# Altium schematic sheet Salico Controller Module.SchDoc
size 558 x 431 mm; SheetNumber: 1; SheetTotal: 1
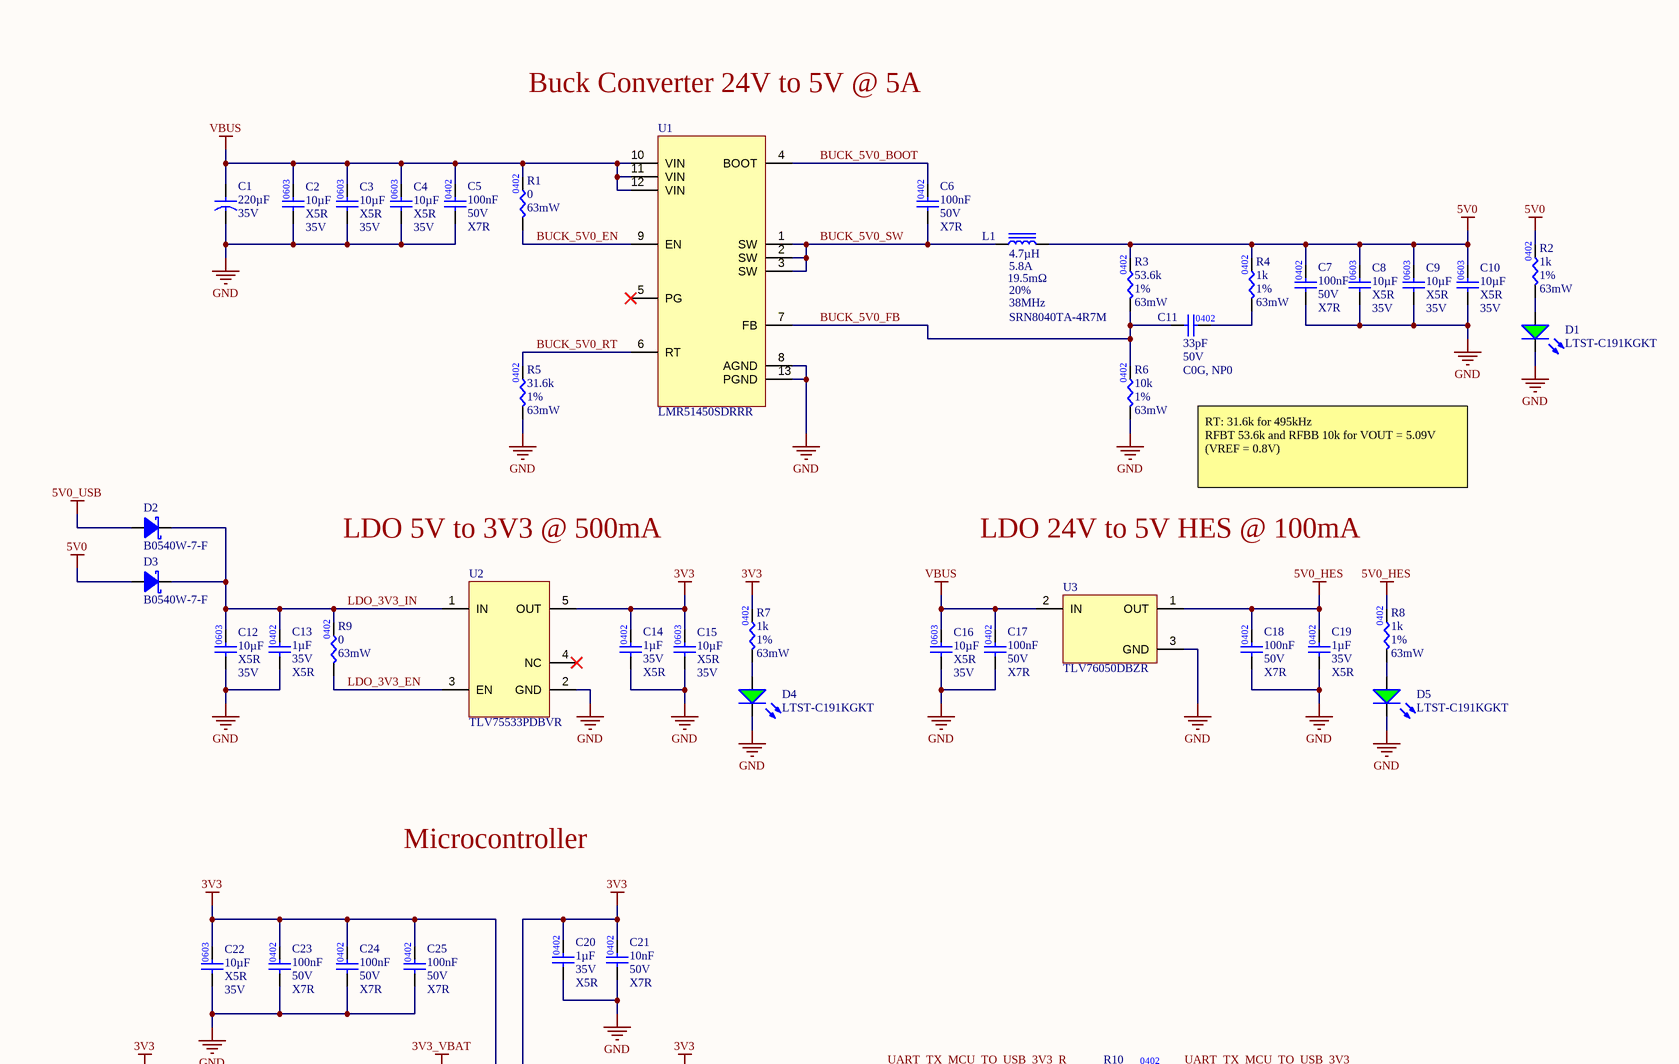
[diagram p0: Salico Controller Module.SchDoc, top left]
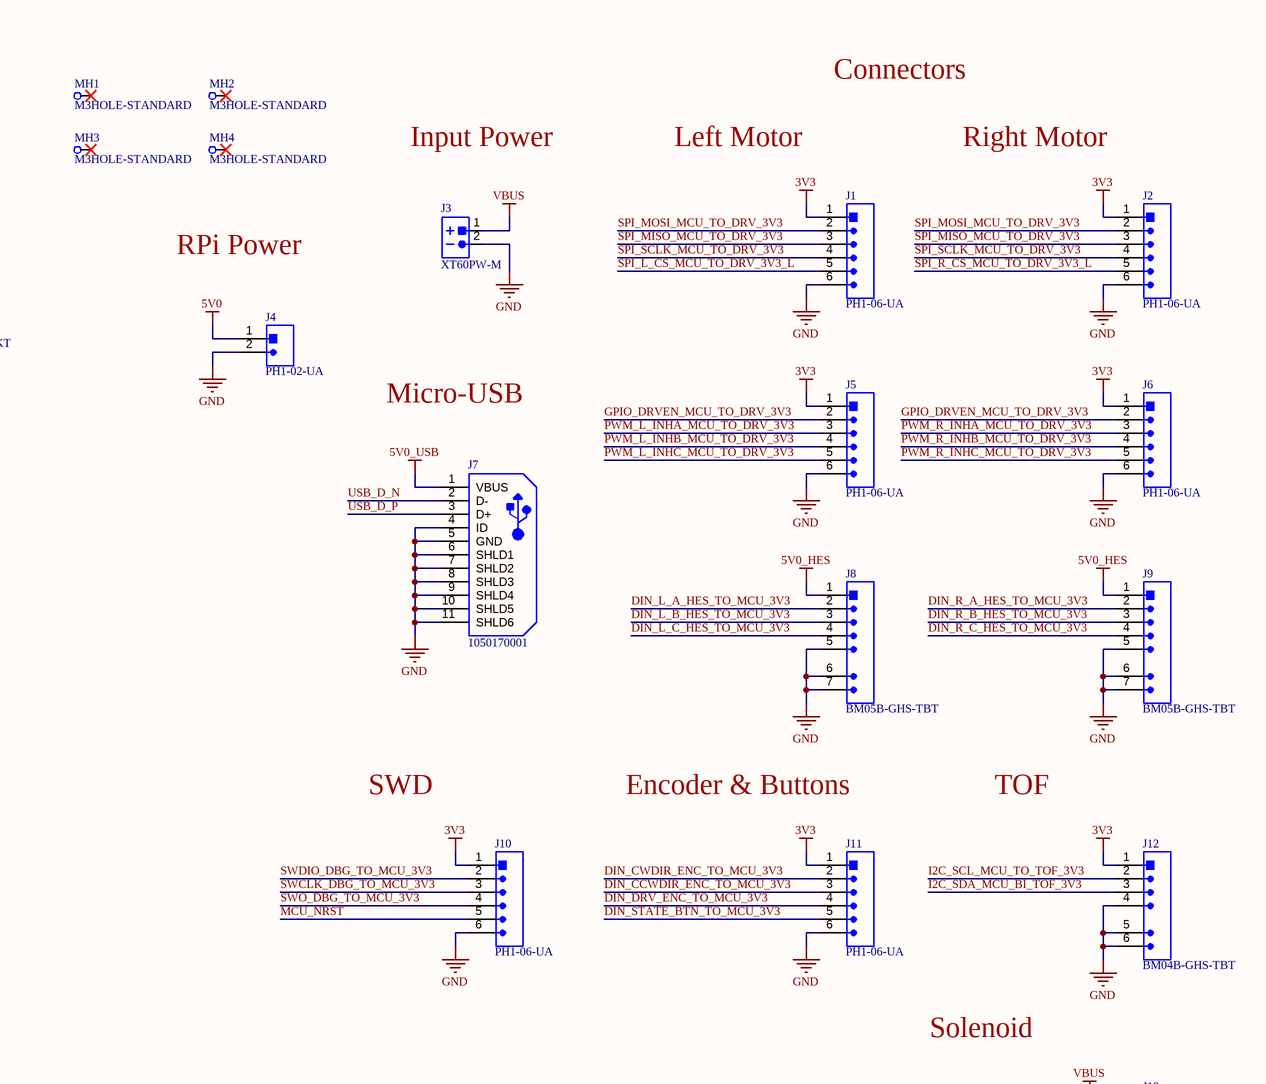
[diagram p1: Salico Controller Module.SchDoc, top right]
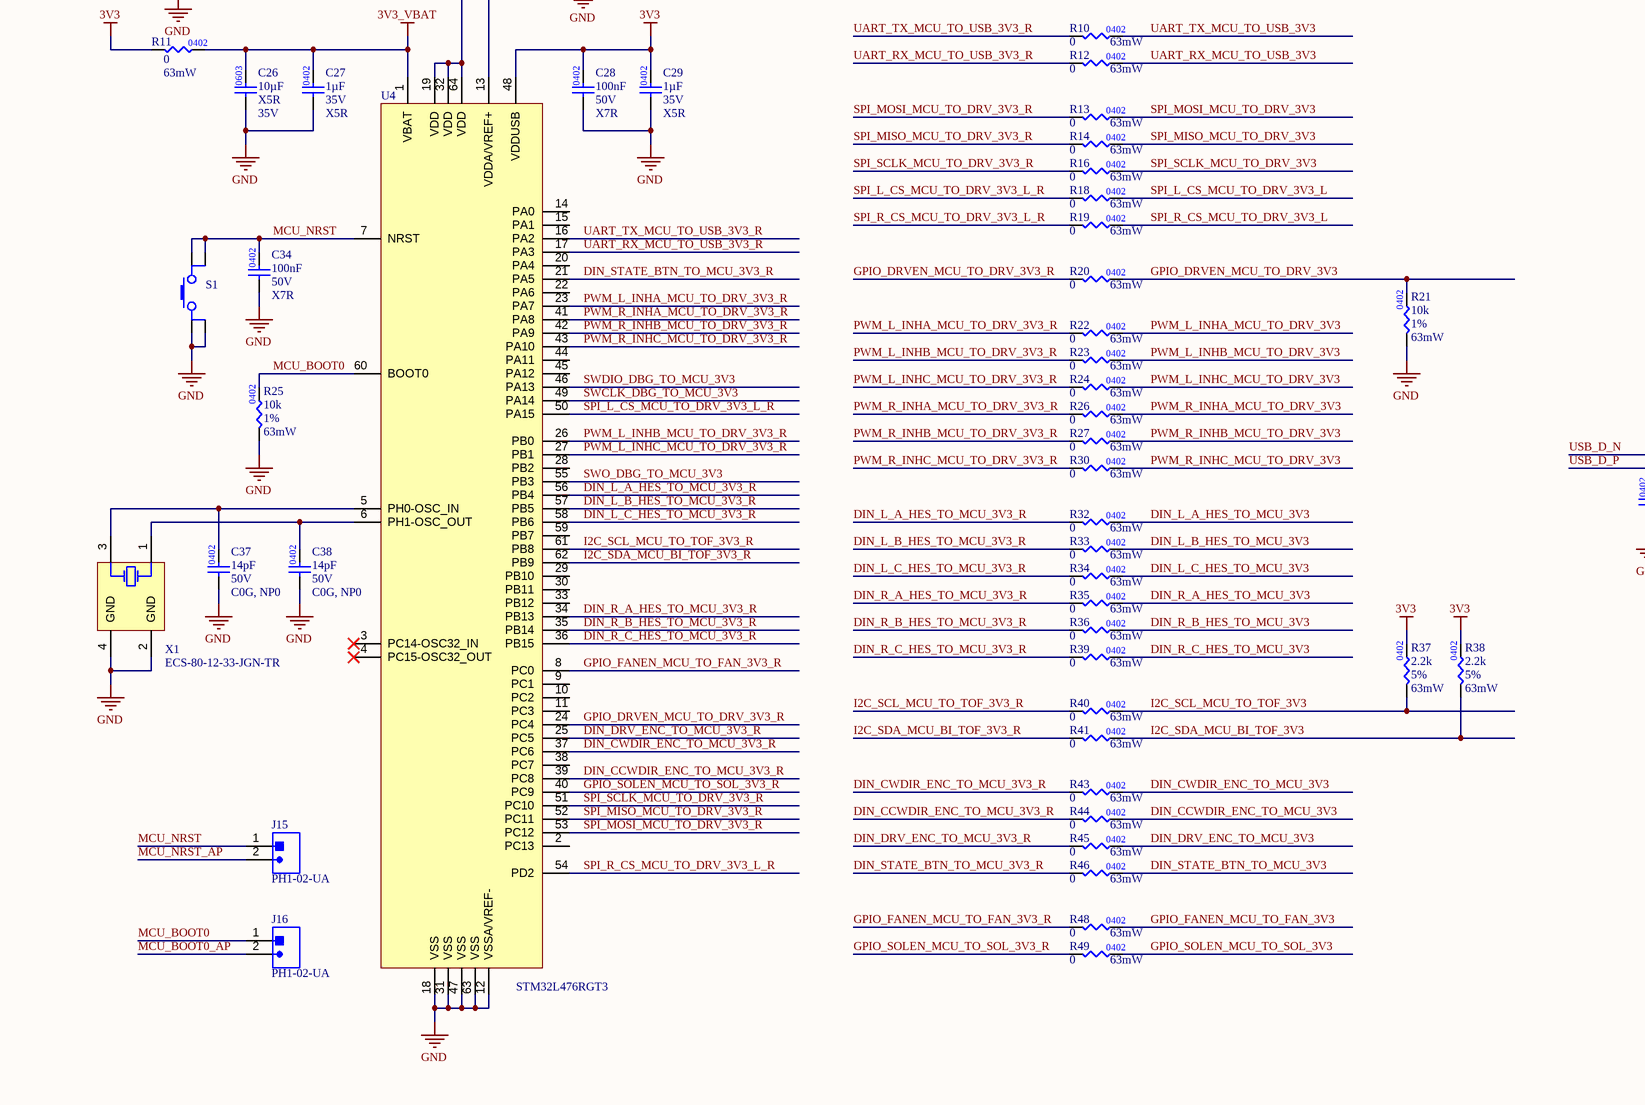
[diagram p2: Salico Controller Module.SchDoc, bottom left]
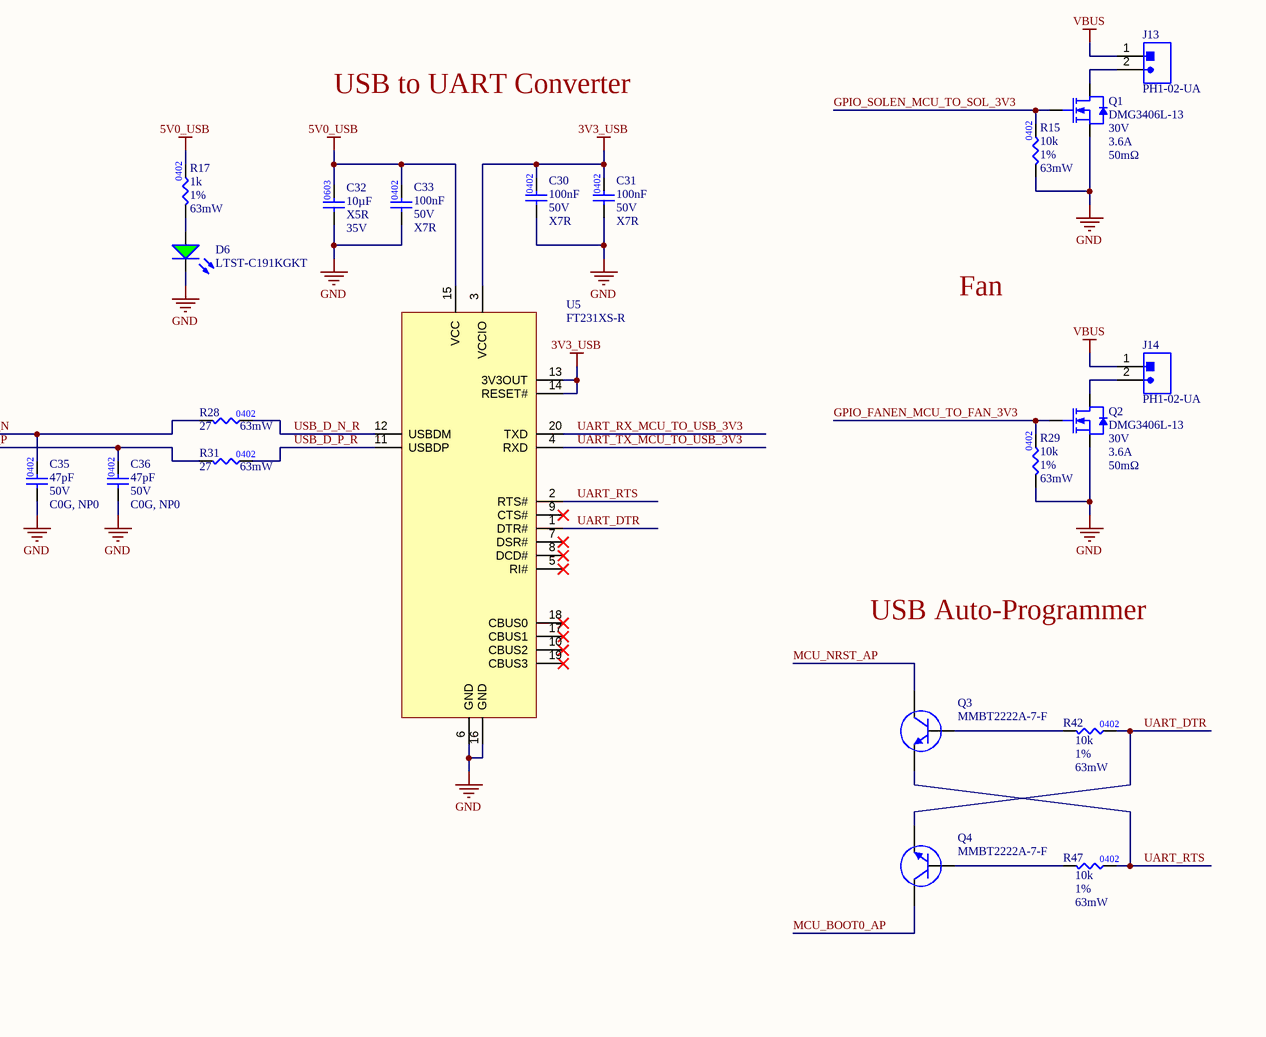
[diagram p3: Salico Controller Module.SchDoc, bottom right]

## Parts
C1  value 220µF  Voltage Rating: 35V  [865080553014-Footprint-1]  (hidden comment: 865080553014)
C2  value 10µF  Temperature Coefficient: X5R  Voltage Rating: 35V  [.CAP_0603-Footprint-1]  (hidden comment: GRM188R6YA106MA73D)
C3  value 10µF  Temperature Coefficient: X5R  Voltage Rating: 35V  [.CAP_0603-Footprint-1]  (hidden comment: GRM188R6YA106MA73D)
C4  value 10µF  Temperature Coefficient: X5R  Voltage Rating: 35V  [.CAP_0603-Footprint-1]  (hidden comment: GRM188R6YA106MA73D)
C5  value 100nF  Voltage Rating: 50V  Temperature Coefficient: X7R  [.CAP_0402-Footprint-1]  (hidden comment: GCM155R71H104KE02D)
C6  value 100nF  Voltage Rating: 50V  Temperature Coefficient: X7R  [.CAP_0402-Footprint-1]  (hidden comment: GCM155R71H104KE02D)
C7  value 100nF  Voltage Rating: 50V  Temperature Coefficient: X7R  [.CAP_0402-Footprint-1]  (hidden comment: GCM155R71H104KE02D)
C8  value 10µF  Temperature Coefficient: X5R  Voltage Rating: 35V  [.CAP_0603-Footprint-1]  (hidden comment: GRM188R6YA106MA73D)
C9  value 10µF  Temperature Coefficient: X5R  Voltage Rating: 35V  [.CAP_0603-Footprint-1]  (hidden comment: GRM188R6YA106MA73D)
C10  value 10µF  Temperature Coefficient: X5R  Voltage Rating: 35V  [.CAP_0603-Footprint-1]  (hidden comment: GRM188R6YA106MA73D)
C11  value 33pF  Voltage Rating: 50V  Temperature Coefficient: C0G, NP0  [.CAP_0402-Footprint-1]  (hidden comment: GRM1555C1H330JA01D)
C12  value 10µF  Temperature Coefficient: X5R  Voltage Rating: 35V  [.CAP_0603-Footprint-1]  (hidden comment: GRM188R6YA106MA73D)
C13  value 1µF  Voltage Rating: 35V  Temperature Coefficient: X5R  [.CAP_0402-Footprint-1]  (hidden comment: GRM155R6YA105KE11D)
C14  value 1µF  Voltage Rating: 35V  Temperature Coefficient: X5R  [.CAP_0402-Footprint-1]  (hidden comment: GRM155R6YA105KE11D)
C15  value 10µF  Temperature Coefficient: X5R  Voltage Rating: 35V  [.CAP_0603-Footprint-1]  (hidden comment: GRM188R6YA106MA73D)
C16  value 10µF  Temperature Coefficient: X5R  Voltage Rating: 35V  [.CAP_0603-Footprint-1]  (hidden comment: GRM188R6YA106MA73D)
C17  value 100nF  Voltage Rating: 50V  Temperature Coefficient: X7R  [.CAP_0402-Footprint-1]  (hidden comment: GCM155R71H104KE02D)
C18  value 100nF  Voltage Rating: 50V  Temperature Coefficient: X7R  [.CAP_0402-Footprint-1]  (hidden comment: GCM155R71H104KE02D)
C19  value 1µF  Voltage Rating: 35V  Temperature Coefficient: X5R  [.CAP_0402-Footprint-1]  (hidden comment: GRM155R6YA105KE11D)
C20  value 1µF  Voltage Rating: 35V  Temperature Coefficient: X5R  [.CAP_0402-Footprint-1]  (hidden comment: GRM155R6YA105KE11D)
C21  value 10nF  Voltage Rating: 50V  Temperature Coefficient: X7R  [.CAP_0402-Footprint-1]  (hidden comment: GCM155R71H103KA55D)
C22  value 10µF  Temperature Coefficient: X5R  Voltage Rating: 35V  [.CAP_0603-Footprint-1]  (hidden comment: GRM188R6YA106MA73D)
C23  value 100nF  Voltage Rating: 50V  Temperature Coefficient: X7R  [.CAP_0402-Footprint-1]  (hidden comment: GCM155R71H104KE02D)
C24  value 100nF  Voltage Rating: 50V  Temperature Coefficient: X7R  [.CAP_0402-Footprint-1]  (hidden comment: GCM155R71H104KE02D)
C25  value 100nF  Voltage Rating: 50V  Temperature Coefficient: X7R  [.CAP_0402-Footprint-1]  (hidden comment: GCM155R71H104KE02D)
C26  value 10µF  Temperature Coefficient: X5R  Voltage Rating: 35V  [.CAP_0603-Footprint-1]  (hidden comment: GRM188R6YA106MA73D)
C27  value 1µF  Voltage Rating: 35V  Temperature Coefficient: X5R  [.CAP_0402-Footprint-1]  (hidden comment: GRM155R6YA105KE11D)
C28  value 100nF  Voltage Rating: 50V  Temperature Coefficient: X7R  [.CAP_0402-Footprint-1]  (hidden comment: GCM155R71H104KE02D)
C29  value 1µF  Voltage Rating: 35V  Temperature Coefficient: X5R  [.CAP_0402-Footprint-1]  (hidden comment: GRM155R6YA105KE11D)
C30  value 100nF  Voltage Rating: 50V  Temperature Coefficient: X7R  [.CAP_0402-Footprint-1]  (hidden comment: GCM155R71H104KE02D)
C31  value 100nF  Voltage Rating: 50V  Temperature Coefficient: X7R  [.CAP_0402-Footprint-1]  (hidden comment: GCM155R71H104KE02D)
C32  value 10µF  Temperature Coefficient: X5R  Voltage Rating: 35V  [.CAP_0603-Footprint-1]  (hidden comment: GRM188R6YA106MA73D)
C33  value 100nF  Voltage Rating: 50V  Temperature Coefficient: X7R  [.CAP_0402-Footprint-1]  (hidden comment: GCM155R71H104KE02D)
C34  value 100nF  Voltage Rating: 50V  Temperature Coefficient: X7R  [.CAP_0402-Footprint-1]  (hidden comment: GCM155R71H104KE02D)
C35  value 47pF  Voltage Rating: 50V  Temperature Coefficient: C0G, NP0  [.CAP_0402-Footprint-1]  (hidden comment: GRM1555C1H470JA01D)
C36  value 47pF  Voltage Rating: 50V  Temperature Coefficient: C0G, NP0  [.CAP_0402-Footprint-1]  (hidden comment: GRM1555C1H470JA01D)
C37  value 14pF  Voltage Rating: 50V  Temperature Coefficient: C0G, NP0  [.CAP_0402-Footprint-1]  (hidden comment: GJM1555C1H140GB01D)
C38  value 14pF  Voltage Rating: 50V  Temperature Coefficient: C0G, NP0  [.CAP_0402-Footprint-1]  (hidden comment: GJM1555C1H140GB01D)
D1  LTST-C191KGKT  [LTST-C191KGKT-Footprint-1]
D2  B0540W-7-F  [B0540W-7-F-Footprint-1]
D3  B0540W-7-F  [B0540W-7-F-Footprint-1]
D4  LTST-C191KGKT  [LTST-C191KGKT-Footprint-1]
D5  LTST-C191KGKT  [LTST-C191KGKT-Footprint-1]
D6  LTST-C191KGKT  [LTST-C191KGKT-Footprint-1]
J1  PH1-06-UA  [PH1-06-UA-Footprint-1]
J2  PH1-06-UA  [PH1-06-UA-Footprint-1]
J3  XT60PW-M  [XT60PW-M-Footprint-1]
J4  PH1-02-UA  [PH1-02-UA-Footprint-1]
J5  PH1-06-UA  [PH1-06-UA-Footprint-1]
J6  PH1-06-UA  [PH1-06-UA-Footprint-1]
J7  1050170001  [1050170001-Footprint-1]
J8  BM05B-GHS-TBT  [BM05B-GHS-TBT-Footprint-1]
J9  BM05B-GHS-TBT  [BM05B-GHS-TBT-Footprint-1]
J10  PH1-06-UA  [PH1-06-UA-Footprint-1]
J11  PH1-06-UA  [PH1-06-UA-Footprint-1]
J12  BM04B-GHS-TBT  [BM04B-GHS-TBT-Footprint-1]
J13  PH1-02-UA  [PH1-02-UA-Footprint-1]
J14  PH1-02-UA  [PH1-02-UA-Footprint-1]
J15  PH1-02-UA  [PH1-02-UA-Footprint-1]
J16  PH1-02-UA  [PH1-02-UA-Footprint-1]
L1  SRN8040TA-4R7M  value 4.7µH  Current Rating: 5.8A  DC Resistance: 19.5mΩ  Tolerance: 20%  Self Resonant Frequency: 38MHz  [SRN8040TA-4R7M-Footprint-1]
MH1  M3HOLE-STANDARD  [M3HOLE-STANDARD-Footprint-1]
MH2  M3HOLE-STANDARD  [M3HOLE-STANDARD-Footprint-1]
MH3  M3HOLE-STANDARD  [M3HOLE-STANDARD-Footprint-1]
MH4  M3HOLE-STANDARD  [M3HOLE-STANDARD-Footprint-1]
Q1  DMG3406L-13  Drain to Source Voltage: 30V  Continuous Drain Current: 3.6A  Rdson: 50mΩ  [DMG3406L-13-Footprint-1]
Q2  DMG3406L-13  Drain to Source Voltage: 30V  Continuous Drain Current: 3.6A  Rdson: 50mΩ  [DMG3406L-13-Footprint-1]
Q3  MMBT2222A-7-F  [MMBT2222A-7-F-Footprint-1]
Q4  MMBT2222A-7-F  [MMBT2222A-7-F-Footprint-1]
R1  value 0  Power: 63mW  [.RES_0402-Footprint-1]  (hidden comment: RC0402JR-070RL)
R2  value 1k  Tolerance: 1%  Power: 63mW  [.RES_0402-Footprint-1]  (hidden comment: RC0402FR-071KL)
R3  value 53.6k  Tolerance: 1%  Power: 63mW  [.RES_0402-Footprint-1]  (hidden comment: RC0402FR-0753K6L)
R4  value 1k  Tolerance: 1%  Power: 63mW  [.RES_0402-Footprint-1]  (hidden comment: RC0402FR-071KL)
R5  value 31.6k  Tolerance: 1%  Power: 63mW  [.RES_0402-Footprint-1]  (hidden comment: RC0402FR-0731K6L)
R6  value 10k  Tolerance: 1%  Power: 63mW  [.RES_0402-Footprint-1]  (hidden comment: RC0402FR-0710KL)
R7  value 1k  Tolerance: 1%  Power: 63mW  [.RES_0402-Footprint-1]  (hidden comment: RC0402FR-071KL)
R8  value 1k  Tolerance: 1%  Power: 63mW  [.RES_0402-Footprint-1]  (hidden comment: RC0402FR-071KL)
R9  value 0  Power: 63mW  [.RES_0402-Footprint-1]  (hidden comment: RC0402JR-070RL)
R10  value 0  Power: 63mW  [.RES_0402-Footprint-1]  (hidden comment: RC0402JR-070RL)
R11  value 0  Power: 63mW  [.RES_0402-Footprint-1]  (hidden comment: RC0402JR-070RL)
R12  value 0  Power: 63mW  [.RES_0402-Footprint-1]  (hidden comment: RC0402JR-070RL)
R13  value 0  Power: 63mW  [.RES_0402-Footprint-1]  (hidden comment: RC0402JR-070RL)
R14  value 0  Power: 63mW  [.RES_0402-Footprint-1]  (hidden comment: RC0402JR-070RL)
R15  value 10k  Tolerance: 1%  Power: 63mW  [.RES_0402-Footprint-1]  (hidden comment: RC0402FR-0710KL)
R16  value 0  Power: 63mW  [.RES_0402-Footprint-1]  (hidden comment: RC0402JR-070RL)
R17  value 1k  Tolerance: 1%  Power: 63mW  [.RES_0402-Footprint-1]  (hidden comment: RC0402FR-071KL)
R18  value 0  Power: 63mW  [.RES_0402-Footprint-1]  (hidden comment: RC0402JR-070RL)
R19  value 0  Power: 63mW  [.RES_0402-Footprint-1]  (hidden comment: RC0402JR-070RL)
R20  value 0  Power: 63mW  [.RES_0402-Footprint-1]  (hidden comment: RC0402JR-070RL)
R21  value 10k  Tolerance: 1%  Power: 63mW  [.RES_0402-Footprint-1]  (hidden comment: RC0402FR-0710KL)
R22  value 0  Power: 63mW  [.RES_0402-Footprint-1]  (hidden comment: RC0402JR-070RL)
R23  value 0  Power: 63mW  [.RES_0402-Footprint-1]  (hidden comment: RC0402JR-070RL)
R24  value 0  Power: 63mW  [.RES_0402-Footprint-1]  (hidden comment: RC0402JR-070RL)
R25  value 10k  Tolerance: 1%  Power: 63mW  [.RES_0402-Footprint-1]  (hidden comment: RC0402FR-0710KL)
R26  value 0  Power: 63mW  [.RES_0402-Footprint-1]  (hidden comment: RC0402JR-070RL)
R27  value 0  Power: 63mW  [.RES_0402-Footprint-1]  (hidden comment: RC0402JR-070RL)
R28  value 27  Power: 63mW  [.RES_0402-Footprint-1]  (hidden comment: RC0402FR-0727RL)
R29  value 10k  Tolerance: 1%  Power: 63mW  [.RES_0402-Footprint-1]  (hidden comment: RC0402FR-0710KL)
R30  value 0  Power: 63mW  [.RES_0402-Footprint-1]  (hidden comment: RC0402JR-070RL)
R31  value 27  Power: 63mW  [.RES_0402-Footprint-1]  (hidden comment: RC0402FR-0727RL)
R32  value 0  Power: 63mW  [.RES_0402-Footprint-1]  (hidden comment: RC0402JR-070RL)
R33  value 0  Power: 63mW  [.RES_0402-Footprint-1]  (hidden comment: RC0402JR-070RL)
R34  value 0  Power: 63mW  [.RES_0402-Footprint-1]  (hidden comment: RC0402JR-070RL)
R35  value 0  Power: 63mW  [.RES_0402-Footprint-1]  (hidden comment: RC0402JR-070RL)
R36  value 0  Power: 63mW  [.RES_0402-Footprint-1]  (hidden comment: RC0402JR-070RL)
R37  value 2.2k  Tolerance: 5%  Power: 63mW  [.RES_0402-Footprint-1]  (hidden comment: RC0402JR-072K2L)
R38  value 2.2k  Tolerance: 5%  Power: 63mW  [.RES_0402-Footprint-1]  (hidden comment: RC0402JR-072K2L)
R39  value 0  Power: 63mW  [.RES_0402-Footprint-1]  (hidden comment: RC0402JR-070RL)
R40  value 0  Power: 63mW  [.RES_0402-Footprint-1]  (hidden comment: RC0402JR-070RL)
R41  value 0  Power: 63mW  [.RES_0402-Footprint-1]  (hidden comment: RC0402JR-070RL)
R42  value 10k  Tolerance: 1%  Power: 63mW  [.RES_0402-Footprint-1]  (hidden comment: RC0402FR-0710KL)
R43  value 0  Power: 63mW  [.RES_0402-Footprint-1]  (hidden comment: RC0402JR-070RL)
R44  value 0  Power: 63mW  [.RES_0402-Footprint-1]  (hidden comment: RC0402JR-070RL)
R45  value 0  Power: 63mW  [.RES_0402-Footprint-1]  (hidden comment: RC0402JR-070RL)
R46  value 0  Power: 63mW  [.RES_0402-Footprint-1]  (hidden comment: RC0402JR-070RL)
R47  value 10k  Tolerance: 1%  Power: 63mW  [.RES_0402-Footprint-1]  (hidden comment: RC0402FR-0710KL)
R48  value 0  Power: 63mW  [.RES_0402-Footprint-1]  (hidden comment: RC0402JR-070RL)
R49  value 0  Power: 63mW  [.RES_0402-Footprint-1]  (hidden comment: RC0402JR-070RL)
S1  PTS647SN38SMTR2 LFS  [PTS647SN38SMTR2 LFS-Footprint-1]  (value not drawn)
U1  LMR51450SDRRR  [SON50P300X80_HS-13N]
U2  TLV75533PDBVR  [TLV75533PDBVR-Footprint-1]
U3  TLV76050DBZR  [TLV76050DBZR-Footprint-1]
U4  STM32L476RGT3  [STM32L476RGT3-Footprint-1]
U5  FT231XS-R  [SOP64P600X175-20N]
X1  ECS-80-12-33-JGN-TR  [ECS-80-12-33-JGN-TR-Footprint-1]

## Nets
3V3: C14.2 C15.2 C20.2 C21.2 C22.2 C23.2 C24.2 C25.2 C28.2 C29.2 J1.1 J2.1 J5.1 J6.1 J10.1 J11.1 J12.1 R7.2 R11.1 R37.2 R38.2 U2.5(OUT) U4.13(VDDA/VREF+) U4.19(VDD) U4.32(VDD) U4.48(VDDUSB) U4.64(VDD)
3V3_USB: C30.2 C31.2 U5.3(VCCIO) U5.13(3V3OUT) U5.14(RESET#)
3V3_VBAT: C26.2 C27.2 R11.2 U4.1(VBAT)
5V0: C7.2 C8.2 C9.2 C10.2 D3.1(Anode) J4.1 L1.2 R2.2 R3.2 R4.2
5V0_HES: C18.2 C19.2 J8.1 J9.1 R8.2 U3.1(OUT)
5V0_USB: C32.2 C33.2 D2.1(Anode) J7.1(VBUS) R17.2 U5.15(VCC)
GND: C1.2 C2.1 C3.1 C4.1 C5.1 C7.1 C8.1 C9.1 C10.1 C12.1 C13.1 C14.1 C15.1 C16.1 C17.1 C18.1 C19.1 C20.1 C21.1 C22.1 C23.1 C24.1 C25.1 C26.1 C27.1 C28.1 C29.1 C30.1 C31.1 C32.1 C33.1 C34.1 C35.1 C36.1 C37.1 C38.1 D1.2(K) D4.2(K) D5.2(K) D6.2(K) J1.6 J2.6 J3.2 J4.2 J5.6 J6.6 J7.4(ID) J7.5(GND) J7.6(SHLD1) J7.7(SHLD2) J7.8(SHLD3) J7.9(SHLD4) J7.10(SHLD5) J7.11(SHLD6) J8.5 J8.6 J8.7 J9.5 J9.6 J9.7 J10.6 J11.6 J12.4 J12.5 J12.6 Q1.2(S) Q2.2(S) R5.1 R6.1 R15.1 R21.1 R25.1 R29.1 S1.1 S1.2 U1.8(AGND) U1.13(PGND) U2.2(GND) U3.3(GND) U4.12(VSSA/VREF-) U4.18(VSS) U4.31(VSS) U4.47(VSS) U4.63(VSS) U5.6(GND) U5.16(GND) X1.2(GND) X1.4(GND)
VBUS: C1.1 C2.2 C3.2 C4.2 C5.2 C16.2 C17.2 J3.1 J13.1 J14.1 R1.2 U1.10(VIN) U1.11(VIN) U1.12(VIN) U3.2(IN)
BUCK_5V0_BOOT: C6.2 U1.4(BOOT)
BUCK_5V0_EN: R1.1 U1.9(EN)
BUCK_5V0_FB: C11.1 R3.1 R6.2 U1.7(FB)
BUCK_5V0_RT: R5.2 U1.6(RT)
BUCK_5V0_SW: C6.1 L1.1 U1.1(SW) U1.2(SW) U1.3(SW)
DIN_CCWDIR_ENC_TO_MCU_3V3: J11.3 R44.2
DIN_CCWDIR_ENC_TO_MCU_3V3_R: R44.1 U4.39(PC8)
DIN_CWDIR_ENC_TO_MCU_3V3: J11.2 R43.2
DIN_CWDIR_ENC_TO_MCU_3V3_R: R43.1 U4.37(PC6)
DIN_DRV_ENC_TO_MCU_3V3: J11.4 R45.2
DIN_DRV_ENC_TO_MCU_3V3_R: R45.1 U4.25(PC5)
DIN_L_A_HES_TO_MCU_3V3: J8.2 R32.2
DIN_L_A_HES_TO_MCU_3V3_R: R32.1 U4.56(PB4)
DIN_L_B_HES_TO_MCU_3V3: J8.3 R33.2
DIN_L_B_HES_TO_MCU_3V3_R: R33.1 U4.57(PB5)
DIN_L_C_HES_TO_MCU_3V3: J8.4 R34.2
DIN_L_C_HES_TO_MCU_3V3_R: R34.1 U4.58(PB6)
DIN_R_A_HES_TO_MCU_3V3: J9.2 R35.2
DIN_R_A_HES_TO_MCU_3V3_R: R35.1 U4.34(PB13)
DIN_R_B_HES_TO_MCU_3V3: J9.3 R36.2
DIN_R_B_HES_TO_MCU_3V3_R: R36.1 U4.35(PB14)
DIN_R_C_HES_TO_MCU_3V3: J9.4 R39.2
DIN_R_C_HES_TO_MCU_3V3_R: R39.1 U4.36(PB15)
DIN_STATE_BTN_TO_MCU_3V3: J11.5 R46.2
DIN_STATE_BTN_TO_MCU_3V3_R: R46.1 U4.21(PA5)
GPIO_DRVEN_MCU_TO_DRV_3V3: J5.2 J6.2 R20.2 R21.2
GPIO_DRVEN_MCU_TO_DRV_3V3_R: R20.1 U4.24(PC4)
GPIO_FANEN_MCU_TO_FAN_3V3: Q2.1(G) R29.2 R48.2
GPIO_FANEN_MCU_TO_FAN_3V3_R: R48.1 U4.8(PC0)
GPIO_SOLEN_MCU_TO_SOL_3V3: Q1.1(G) R15.2 R49.2
GPIO_SOLEN_MCU_TO_SOL_3V3_R: R49.1 U4.40(PC9)
I2C_SCL_MCU_TO_TOF_3V3: J12.2 R37.1 R40.2
I2C_SCL_MCU_TO_TOF_3V3_R: R40.1 U4.61(PB8)
I2C_SDA_MCU_BI_TOF_3V3: J12.3 R38.1 R41.2
I2C_SDA_MCU_BI_TOF_3V3_R: R41.1 U4.62(PB9)
LDO_3V3_EN: R9.1 U2.3(EN)
LDO_3V3_IN: C12.2 C13.2 D2.2(Cathode) D3.2(Cathode) R9.2 U2.1(IN)
MCU_BOOT0: J16.1 R25.2 U4.60(BOOT0)
MCU_BOOT0_AP: J16.2 Q4.3(C)
MCU_NRST: C34.2 J10.5 J15.1 S1.3 S1.4 U4.7(NRST)
MCU_NRST_AP: J15.2 Q3.3(C)
PWM_L_INHA_MCU_TO_DRV_3V3: J5.3 R22.2
PWM_L_INHA_MCU_TO_DRV_3V3_R: R22.1 U4.23(PA7)
PWM_L_INHB_MCU_TO_DRV_3V3: J5.4 R23.2
PWM_L_INHB_MCU_TO_DRV_3V3_R: R23.1 U4.26(PB0)
PWM_L_INHC_MCU_TO_DRV_3V3: J5.5 R24.2
PWM_L_INHC_MCU_TO_DRV_3V3_R: R24.1 U4.27(PB1)
PWM_R_INHA_MCU_TO_DRV_3V3: J6.3 R26.2
PWM_R_INHA_MCU_TO_DRV_3V3_R: R26.1 U4.41(PA8)
PWM_R_INHB_MCU_TO_DRV_3V3: J6.4 R27.2
PWM_R_INHB_MCU_TO_DRV_3V3_R: R27.1 U4.42(PA9)
PWM_R_INHC_MCU_TO_DRV_3V3: J6.5 R30.2
PWM_R_INHC_MCU_TO_DRV_3V3_R: R30.1 U4.43(PA10)
SPI_L_CS_MCU_TO_DRV_3V3_L: J1.5 R18.2
SPI_L_CS_MCU_TO_DRV_3V3_L_R: R18.1 U4.50(PA15)
SPI_MISO_MCU_TO_DRV_3V3: J1.3 J2.3 R14.2
SPI_MISO_MCU_TO_DRV_3V3_R: R14.1 U4.52(PC11)
SPI_MOSI_MCU_TO_DRV_3V3: J1.2 J2.2 R13.2
SPI_MOSI_MCU_TO_DRV_3V3_R: R13.1 U4.53(PC12)
SPI_R_CS_MCU_TO_DRV_3V3_L: J2.5 R19.2
SPI_R_CS_MCU_TO_DRV_3V3_L_R: R19.1 U4.54(PD2)
SPI_SCLK_MCU_TO_DRV_3V3: J1.4 J2.4 R16.2
SPI_SCLK_MCU_TO_DRV_3V3_R: R16.1 U4.51(PC10)
SWCLK_DBG_TO_MCU_3V3: J10.3 U4.49(PA14)
SWDIO_DBG_TO_MCU_3V3: J10.2 U4.46(PA13)
SWO_DBG_TO_MCU_3V3: J10.4 U4.55(PB3)
UART_DTR: Q4.1(E) R42.2 U5.1(DTR#)
UART_RTS: Q3.1(E) R47.2 U5.2(RTS#)
UART_RX_MCU_TO_USB_3V3: R12.2 U5.20(TXD)
UART_RX_MCU_TO_USB_3V3_R: R12.1 U4.17(PA3)
UART_TX_MCU_TO_USB_3V3: R10.2 U5.4(RXD)
UART_TX_MCU_TO_USB_3V3_R: R10.1 U4.16(PA2)
USB_D_N: C35.2 J7.2(D-) R28.1
USB_D_N_R: R28.2 U5.12(USBDM)
USB_D_P: C36.2 J7.3(D+) R31.1
USB_D_P_R: R31.2 U5.11(USBDP)
NetC11_2: C11.2 R4.1
NetC37_2: C37.2 U4.5(PH0-OSC_IN) X1.3
NetC38_2: C38.2 U4.6(PH1-OSC_OUT) X1.1
NetD1_1: D1.1(A) R2.1
NetD4_1: D4.1(A) R7.1
NetD5_1: D5.1(A) R8.1
NetD6_1: D6.1(A) R17.1
NetJ13_2: J13.2 Q1.3(D)
NetJ14_2: J14.2 Q2.3(D)
NetQ3_2: Q3.2(B) R42.1
NetQ4_2: Q4.2(B) R47.1

Not connected (* = marked no-connect by the designer): MH1 1*; MH2 1*; MH3 1*; MH4 1*; U1 5(PG)*; U2 4(NC)*; U4 2(PC13) 3(PC14-OSC32_IN)* 4(PC15-OSC32_OUT)* 9(PC1) 10(PC2) 11(PC3) 14(PA0) 15(PA1) 20(PA4) 22(PA6) 28(PB2) 29(PB10) 30(PB11) 33(PB12) 38(PC7) 44(PA11) 45(PA12) 59(PB7); U5 5(RI#)* 7(DSR#)* 8(DCD#)* 9(CTS#)* 10(CBUS2)* 17(CBUS1)* 18(CBUS0)* 19(CBUS3)*

## Notes on the sheet
- Buck Converter 24V to 5V @ 5A
- Connectors
- Input Power
- Left Motor
- Right Motor
- RPi Power
- Micro-USB
- LDO 5V to 3V3 @ 500mA
- LDO 24V to 5V HES @ 100mA
- RT: 31.6k for 495kHz
  RFBT 53.6k and RFBB 10k for VOUT = 5.09V (VREF = 0.8V)
- SWD
- Encoder & Buttons
- TOF
- Microcontroller
- Solenoid
- USB to UART Converter
- Fan
- USB Auto-Programmer
- DWG. NO.
- REV.
- SHT.
- REVISION
- DESCRIPTION
- DATE
- APPROVED
- THIS DOCUMENT AND THE DATA DISCLOSED HEREIN OR HEREWITH IS THE PROPERTY OF ALTIUM LIMITED AND MAY BE FREELY DISTRIBUTED IN WHOLE. NO RIGHTS ARE RESERVED OR EXPRESS OR IMPLIED WARANTEE GIVEN.
- ENG:
- DSN:
- APPROVALS
- PROJECT
- DOCUMENT REVISION:
- DESIGN ITEM:
- CHK:
- BOM:
- REFERENCE DOCUMENTS
- PROJECT REVISION:
- TITLE
- FAB DWG:
- PCB DWG:
- ASSY DWG:
- SCALE:
- SIZE
- C
- CAGE CODE
- FILE NAME
- DWG NO.
- SHEET
- OF
- REV

## Library data of the parts
C1 = CMP-001-00089-1: CAP ALUM 220UF 20% 35V SMD; Capacitor Type: Aluminum Electrolytic; Tolerance: 20%; Mounting Technology: Surface Mount; Case/Package: Radial, Can - SMD; Pins: 2
C2-C4 C8-C10 C12 C15 C16 C22 C26 C32 = CMP-001-00088-2: CAP CER 10UF 35V X5R 0603; Capacitor Type: MLCC; Tolerance: 20%; Mounting Technology: Surface Mount; Pins: 2; Case/Package: 0603
C5-C7 C17 C18 C23-C25 C28 C30 C31 C33 C34 = CMP-001-00084-4: CAP CER 0.1UF 50V X7R 0402; Tolerance: 10%; Capacitor Type: MLCC; Pins: 2; Case/Package: 0402; Mounting Technology: Surface Mount
C11 = CMP-001-00090-2: CAP CER 33PF 50V C0G/NP0 0402; Tolerance: 5%; Capacitor Type: MLCC; Pins: 2; Case/Package: 0402; Mounting Technology: Surface Mount
C13 C14 C19 C20 C27 C29 = CMP-001-00091-1: CAP CER 1UF 35V X5R 0402; Capacitor Type: MLCC; Tolerance: 10%; Mounting Technology: Surface Mount; Case/Package: 0402; Pins: 2
C21 = CMP-001-00092-1: CAP CER 10000PF 50V X7R 0402; Tolerance: 10%; Capacitor Type: MLCC; Pins: 2; Case/Package: 0402; Mounting Technology: Surface Mount
C35 C36 = CMP-001-00093-1: CAP CER 47PF 50V C0G/NP0 0402; Capacitor Type: MLCC; Tolerance: 5%; Case/Package: 0402; Mounting Technology: Surface Mount; Pins: 2
C37 C38 = CMP-001-00094-1: CAP CER 14PF 50V C0G/NP0 0402; Capacitor Type: MLCC; Tolerance: 2%; Case/Package: 0402; Pins: 2; Mounting Technology: Surface Mount
D1 D4-D6 = CMP-004-00031-4: LED GREEN CLEAR SMD; Forward Voltage: 2V; Case/Package: 0603; Mounting Technology: Surface Mount; Pins: 2
D2 D3 = CMP-004-00032-1: DIODE SCHOTTKY 40V 500MA SOD123; Forward Voltage: 510mV; Case/Package: SOD-123; Mounting Technology: Surface Mount; Forward Current: 500mA; Pins: 2
J1 J2 J5 J6 J10 J11 = CMP-002-00074-2: CONN HEADER VERT 6POS 2.54MM; Gender: Male; Connector Type: Header; Pins: 6; Mounting Technology: Surface Mount
J3 = CMP-002-00071-2: XT60PW-M Connector; Connector Type: Through Hole; Gender: Male; Pins: 2
J4 J13-J16 = CMP-002-00077-2: CONN HEADER VERT 2POS 2.54MM; Gender: Male; Mounting Technology: Surface Mount; Pins: 2; Connector Type: Header
J7 = CMP-002-00078-2: CONN RCPT USB2.0 MICRO B SMD R/A; Gender: Receptacle; Connector Type: USB Micro B; Pins: 5; Mounting Technology: Surface Mount
J8 J9 = CMP-002-00079-2: CONN HEADER SMD 5POS 1.25MM; Gender: Receptacle; Max Current Rating: 1A; Connector Type: Header; Pins: 5; Mounting Technology: Suface Mount
J12 = CMP-002-00080-2: CONN HEADER SMD 4POS 1.25MM; Max Current Rating: 1A; Gender: Receptacle; Connector Type: Header; Pins: 4; Mounting Technology: Surface Mount
L1 = CMP-006-00021-3: FIXED IND 4.7UH 5.8A 19.5MOHM SM; Shielding: Shielded; Saturation Current: 6.7A; Pins: 2; Mounting Technology: Surface Mount
MH1-MH4 = CMP-00030-00001-1: M3 Mounting Hole
Q1 Q2 = CMP-013-00035-1: MOSFET N-CH 30V 3.6A SOT23; Transistor Type: N-Channel; Gate Charge(Qg) (Max) @ Vgs: 11.2nC; Vgs(th) (Max) @ Id: 2V; Mounting Technology: Surface Mount; Case/Package: SOT-23-3
Q3 Q4 = CMP-013-00036-1: TRANS NPN 40V 0.6A SOT-23-3; Mounting Technology: Surface Mount; Pins: 3; Case/Package: SOT-23-3
R1 R9-R14 R16 R18-R20 R22-R24 R26 R27 R30 R32-R36 R39-R41 R43-R46 R48 R49 = CMP-009-00180-2: RES 0 OHM JUMPER 1/16W 0402; Mounting Technology: Surface Mount; Case/Package: 0402
R2 R4 R7 R8 R17 = CMP-009-00185-1: RES 1K OHM 1% 1/16W 0402; Case/Package: 0402; Mounting Technology: Surface Mount; Pins: 2
R3 = CMP-009-00184-1: RES 53.6K OHM 1% 1/16W 0402; Pins: 2; Mounting Technology: Surface Mount; Case/Package: 0402
R5 = CMP-009-00186-1: RES 31.6K OHM 1% 1/16W 0402; Pins: 2; Case/Package: 0402; Mounting Technology: Surface Mount
R6 R15 R21 R25 R29 R42 R47 = CMP-009-00179-2: RES 10K OHM 1% 1/16W 0402; Case/Package: 0402; Pins: 2
R28 R31 = CMP-009-00188-1: RES 27 OHM 1% 1/16W 0402; Tolerance: 1%; Pins: 2; Case/Package: 0402; Mounting Technology: Surface Mount
R37 R38 = CMP-009-00187-1: RES 2.2K OHM 5% 1/16W 0402; Pins: 2; Case/Package: 0402; Mounting Technology: Surface Mount
S1 = CMP-011-00013-2: SWITCH TACTILE SPST-NO 0.05A 12V; Current Rating: 50mA; Voltage Rating: 12V; Mounting Technology: Surface Mount; Pins: 4; Throw Configuration: SPST-NO
U1 = CMP-019-00050-8: IC REG BUCK ADJ 5A 12WSON; Min Supply Voltage: 4V; Output Voltage: 28V; Max Supply Voltage: 36V; Case/Package: 12-WSON; Output Current: 5A; Mounting Technology: Surface Mount
U2 = CMP-019-00051-4: IC REG LINEAR 3.3V 500MA SOT23-5; Dropout Voltage: 238mV; Min Supply Voltage: 1.45V; Max Supply Voltage: 5.5V; Mounting Technology: Surface Mount; Case/Package: SOT-23-5; Min Operating Temperature: -40°C; Output Voltage: 3.3V; Output Current: 500mA; Max Operating Temperature: 125°C
U3 = CMP-019-00052-1: IC REG LINEAR 5V 100MA SOT23-3; Dropout Voltage: 1.1V; Max Supply Voltage: 30V; Output Voltage: 5V; Mounting Technology: Surface Mount; Output Current: 100mA; Case/Package: SOT-23-3
U4 = CMP-020-00023-4: IC MCU 32BIT 1MB FLASH 64LQFP; Max Supply Voltage: 3.6V; RAM Size: 128K x 8; Min Supply Voltage: 1.71V; I/Os: 51; Mounting Technology: Surface Mount; Case/Package: 64-LQFP
U5 = CMP-020-00024-2: IC USB SERIAL FULL UART 20SSOP; Max Supply Voltage: 5V; Min Supply Voltage: 3.3V; Mounting Technology: Surface Mount; Pins: 20
X1 = CMP-003-00030-1: CRYSTAL 8.0000MHZ 12PF SMD; Frequency: 8MHz; ESR: 400; Mounting Technology: Surface Mount; Load Capacitance: 12pF; Pins: 4